# Altium schematic sheet LPCB220 - MLP INTERFACE.SchDoc
size A3; Address1: Factory 10; Address2: 9-13 Dingley Avenue, Dandeong, VICTORIA 3175, AUSTRALIA; DocumentNumber: 11; Revision: 1; SheetNumber: 11; SheetTotal: 18; Lockie__PCB_SUB_ASSEMBLY: MLP Top Level; Lockie__PCB_ASSEMBLY: Brake Control; Lockie__LDL: LPCB220; Lockie__PCB_DESCRIPTION: Redundant Stepper Node
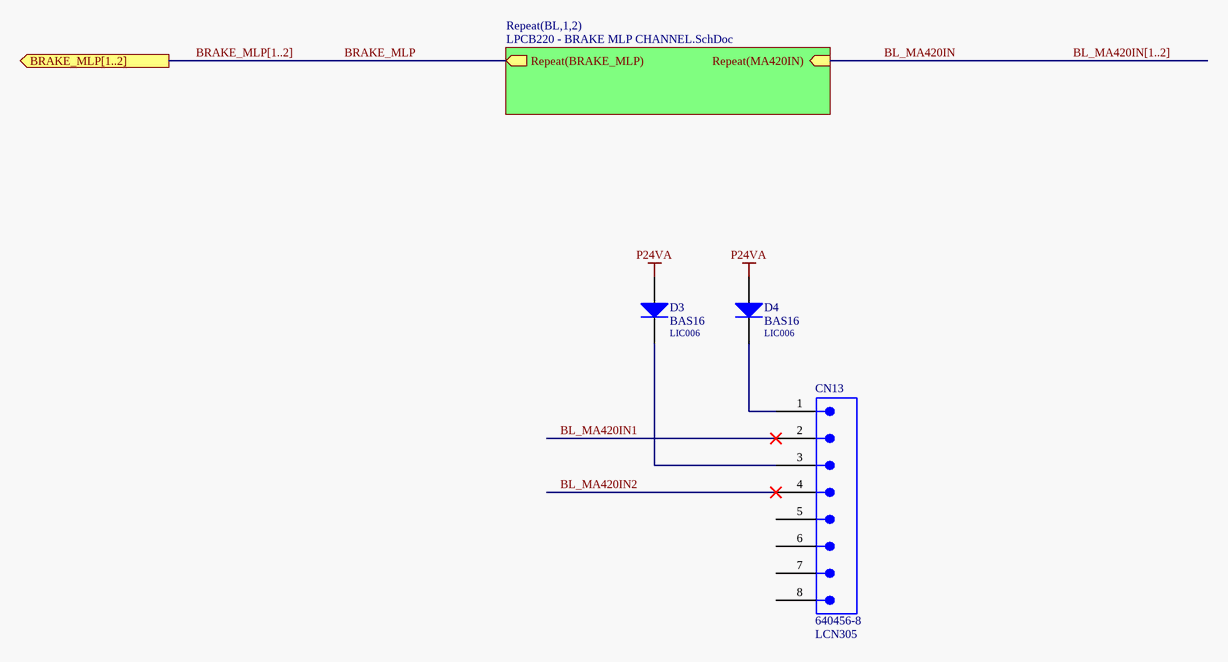
[diagram p0: LPCB220 - MLP INTERFACE.SchDoc]

## Parts
CN13  640456-8  LDL_NUMBER: LCN305  [640456-8]
D3  BAS16  LDL_NUMBER: LIC006  [LFP021__SOT23]
D4  BAS16  LDL_NUMBER: LIC006  [LFP021__SOT23]

## Sub-sheets
Repeat(BL,1,2) = LPCB220 - BRAKE MLP CHANNEL.SchDoc: Repeat(MA420IN) (in), Repeat(BRAKE_MLP) (out)

## Ports
BRAKE_MLP[1..2] (out)

## Nets
P24VA: D3.1(A) D4.1(A)
BL_MA420IN: sheet Repeat(BL,1,2)/Repeat(MA420IN)
BL_MA420IN1: CN13.2
BL_MA420IN2: CN13.4
BRAKE_MLP: sheet Repeat(BL,1,2)/Repeat(BRAKE_MLP)
NetCN13_1: CN13.1 D4.3(K)
NetCN13_3: CN13.3 D3.3(K)

Not connected (* = marked no-connect by the designer): CN13 5 6 7 8

## Buses and harness runs
bus BL_MA420IN[1..2]
bus BRAKE_MLP[1..2] = port BRAKE_MLP[1..2]

## Notes on the sheet
- PCB COMPONENT DESCRIPTION
- LDL NUMBER
- Assembly Details
- Size
- Drawing File Name
- Revision
- http://rloop.org
- Scale
- A3
- Sheet Details
- N.T.S
- Sheet:
- Of:

## Library data of the parts
CN13 = 640456-8: Connector, Male Header, 8 Way; FMEDA__CHANNEL: COM; FMEDA__OPERATING__CURRENT_MAX: 0; FMEDA__OPERATING__TEMP_MAX: 50; FMEDA__OPERATING__TEMP_MIN: -20; FMEDA__OPERATING__TEMP_TYP: 27; FMEDA__OPERATING__VOLTAGE_MAX: 16; FMEDA__OPERATING__VOLTAGE_TYP: 12; FMEDA__FUNCTION_IN_SYSTEM: *; FMEDA__OPERATING__CURRENT_MIN: 0; FMEDA__OPERATING__CURRENT_TYP: 0; FMEDA__OPERATING__VOLTAGE_MIN: 0
D3 D4 = BAS16: Diode, Small Signal, 0.2A, 85V, SMD SOT-23 [LIC006]; FMEDA__OPERATING__CURRENT_MIN: 0; FMEDA__OPERATING__TEMP_MIN: -20; FMEDA__OPERATING__TEMP_TYP: 27; FMEDA__OPERATING__TEMP_MAX: 50; FMEDA__CHANNEL: COM; FMEDA__OPERATING__CURRENT_MAX: 0; FMEDA__OPERATING__VOLTAGE_MIN: 0; FMEDA__OPERATING__VOLTAGE_MAX: 0; FMEDA__FUNCTION_IN_SYSTEM: *; FMEDA__OPERATING__CURRENT_TYP: 0; FMEDA__OPERATING__VOLTAGE_TYP: 0